# Altium project ONDULADOR.PrjPcb
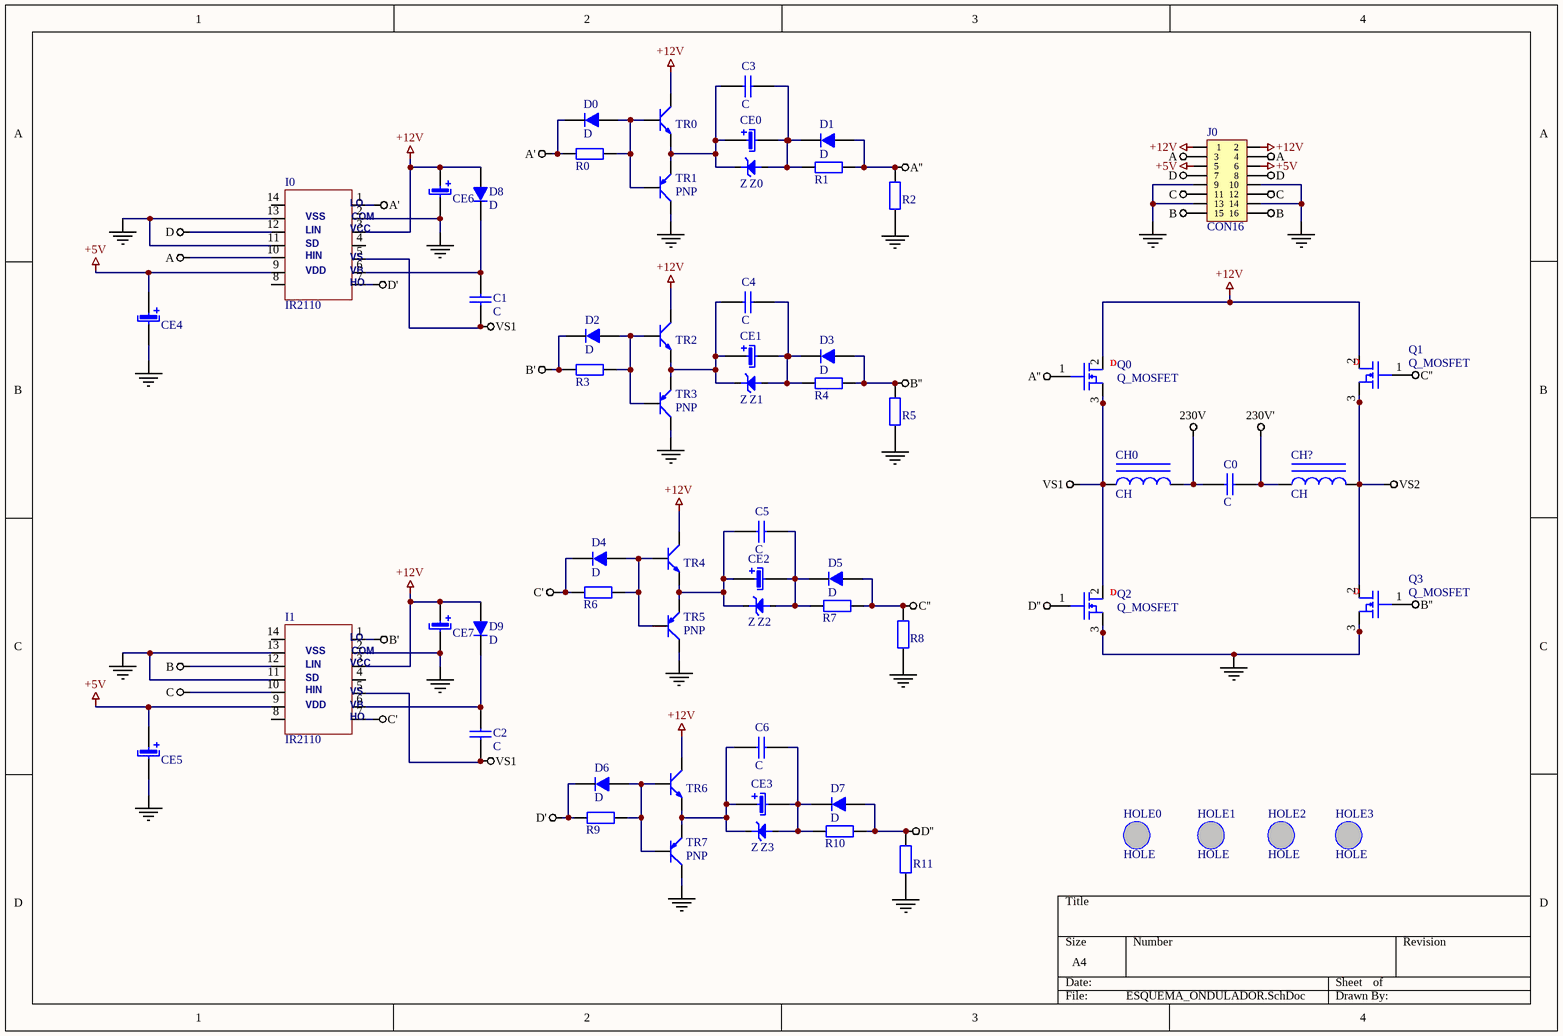
[diagram p0: ESQUEMA_ONDULADOR.SchDoc]
1 sheet, 62 parts. Net scope: global (net labels, ports and power ports of the same name join across sheets).
Board files: ONDULADOR_PCB_PIC.PcbDoc, ONDULADOR_PCB_POTENCIA.PcbDoc

## Sheet ESQUEMA_ONDULADOR.SchDoc
size A4

### Parts
C0  C  [C9_25X9I6]
C1  C  [C2_7I5X2I5]
C2  C  [C2_7I5X2I5]
C3  C  [C2_7I5X2I5]
C4  C  [C2_7I5X2I5]
C5  C  [C2_7I5X2I5]
C6  C  [C2_7I5X2I5]
CE0  CE  [CP1_D5I5]  (value not drawn)
CE1  CE  [CP1_D5I5]  (value not drawn)
CE2  CE  [CP1_D5I5]  (value not drawn)
CE3  CE  [CP1_D5I5]  (value not drawn)
CE4  CE  [CP1_D5I5]  (value not drawn)
CE5  CE  [CP1_D5I5]  (value not drawn)
CE6  CE  [CP1_D5I5]  (value not drawn)
CE7  CE  [CP1_D5I5]  (value not drawn)
CH0  CH  [E65H]
CH?  CH  [E65H]
D0  D  [DO41]
D1  D  [DO41]
D2  D  [DO41]
D3  D  [DO41]
D4  D  [DO41]
D5  D  [DO41]
D6  D  [DO41]
D7  D  [DO41]
D8  D  [DO41]
D9  D  [DO41]
HOLE0  HOLE  [HOLE3_D6]
HOLE1  HOLE  [HOLE3_D6]
HOLE2  HOLE  [HOLE3_D6]
HOLE3  HOLE  [HOLE3_D6]
I0  IR2110  [DIP14]
I1  IR2110  [DIP14]
J0  CON16  [CON16]
Q0  Q_MOSFET  [TO220/TO-3P]
Q1  Q_MOSFET  [TO220/TO-3P]
Q2  Q_MOSFET  [TO220/TO-3P]
Q3  Q_MOSFET  [TO220/TO-3P]
R0  R  [R1/4]  (value not drawn)
R1  R  [R1/4]  (value not drawn)
R2  R  [R1/4]  (value not drawn)
R3  R  [R1/4]  (value not drawn)
R4  R4  [R1/4]  (value not drawn)
R5  R5  [R1/4]  (value not drawn)
R6  R  [R1/4]  (value not drawn)
R7  R4  [R1/4]  (value not drawn)
R8  R5  [R1/4]  (value not drawn)
R9  R  [R1/4]  (value not drawn)
R10  R4  [R1/4]  (value not drawn)
R11  R5  [R1/4]  (value not drawn)
TR0  NPN  [TO220BCE]  (value not drawn)
TR1  PNP  [TO220BCE]
TR2  NPN  [TO220BCE]  (value not drawn)
TR3  PNP  [TO220BCE]
TR4  NPN  [TO220BCE]  (value not drawn)
TR5  PNP  [TO220BCE]
TR6  NPN  [TO220BCE]  (value not drawn)
TR7  PNP  [TO220BCE]
Z0  Z  [DO35]
Z1  Z  [DO35]
Z2  Z  [DO35]
Z3  Z  [DO35]

### Nets
230V: C0.1 CH0.2
230V': C0.2 CH?.1
+5V: CE4.1 CE5.1 I0.9 I1.9 J0.5 J0.6
+12V: CE6.1 CE7.1 D8.1 D9.1 I0.3 I1.3 J0.1 J0.2 Q0.2 Q1.2 TR0.1 TR2.1 TR4.1 TR6.1
A: I0.10 J0.3 J0.4
A': D0.2 I0.1 R0.1
A'': D1.1 Q0.1 R1.2 R2.2
B: I1.12 J0.15 J0.16
B': D2.2 I1.1 R3.1
B'': D3.1 Q3.1 R4.2 R5.2
C: I1.10 J0.11 J0.12
C': D4.2 I1.7 R6.1
C'': D5.1 Q1.1 R7.2 R8.2
D: I0.12 J0.7 J0.8
D': D6.2 I0.7 R9.1
D'': D7.1 Q2.1 R10.2 R11.2
NetCE4_2: CE4.2 CE5.2 CE6.2 CE7.2 I0.2 I0.11 I0.13 I1.2 I1.11 I1.13 J0.9 J0.10 J0.13 J0.14 Q2.3 Q3.3 R2.1 R5.1 R8.1 R11.1 TR1.3 TR3.3 TR5.3 TR7.3
VS1: C1.2 C2.2 CH0.1 I0.5 I1.5 Q0.3 Q2.2
VS2: CH?.2 Q1.3 Q3.2
NetC1_1: C1.1 D8.2 I0.6
NetC2_1: C2.1 D9.2 I1.6
NetC3_1: C3.1 CE0.1 TR0.3 TR1.1 Z0.2
NetC3_2: C3.2 CE0.2 D1.2 R1.1 Z0.1
NetC4_1: C4.1 CE1.1 TR2.3 TR3.1 Z1.2
NetC4_2: C4.2 CE1.2 D3.2 R4.1 Z1.1
NetC5_1: C5.1 CE2.1 TR4.3 TR5.1 Z2.2
NetC5_2: C5.2 CE2.2 D5.2 R7.1 Z2.1
NetC6_1: C6.1 CE3.1 TR6.3 TR7.1 Z3.2
NetC6_2: C6.2 CE3.2 D7.2 R10.1 Z3.1
NetD0_1: D0.1 R0.2 TR0.2 TR1.2
NetD2_1: D2.1 R3.2 TR2.2 TR3.2
NetD4_1: D4.1 R6.2 TR4.2 TR5.2
NetD6_1: D6.1 R9.2 TR6.2 TR7.2

Not connected (* = marked no-connect by the designer): I0 4 8 14; I1 4 8 14

### Notes on the sheet
- (in symbol IR2110) LO; VSS; COM; LIN; VCC; SD; HIN; VS; VDD; VB; HO
- (in symbol Q_MOSFET) D

### Library data of the parts
CH0 CH? = CH: ;CH?; ; ; ; ;Bobina con nucleo ;5
HOLE0-HOLE3 = HOLE: ;HOLE? ;HOLE3_D6 ; ; ;Agujero ;20
J0 = CON16: ;J? ;CON5 ;CON5_2i54VE_JST_B2PVH ;CON5_7I62_STL960-HG-3 ;CON5_2I54V;Conector de 5 pins simples ;17
Q0-Q3 = Q_MOSFET: ;Q? ;TO92EBC ;TO220BCE ;SOT23 ;TO126 ;Transistor NPN Generico ;13
R4 R5 R7 R8 R10 R11 = R
Z0-Z3 = Z: ;Z? ;SOD80 ;1N4004 ;1N ;SOD57 ;Zenner generico ;11